# EAGLE schematic telemetry (EAGLE 9.2.1)
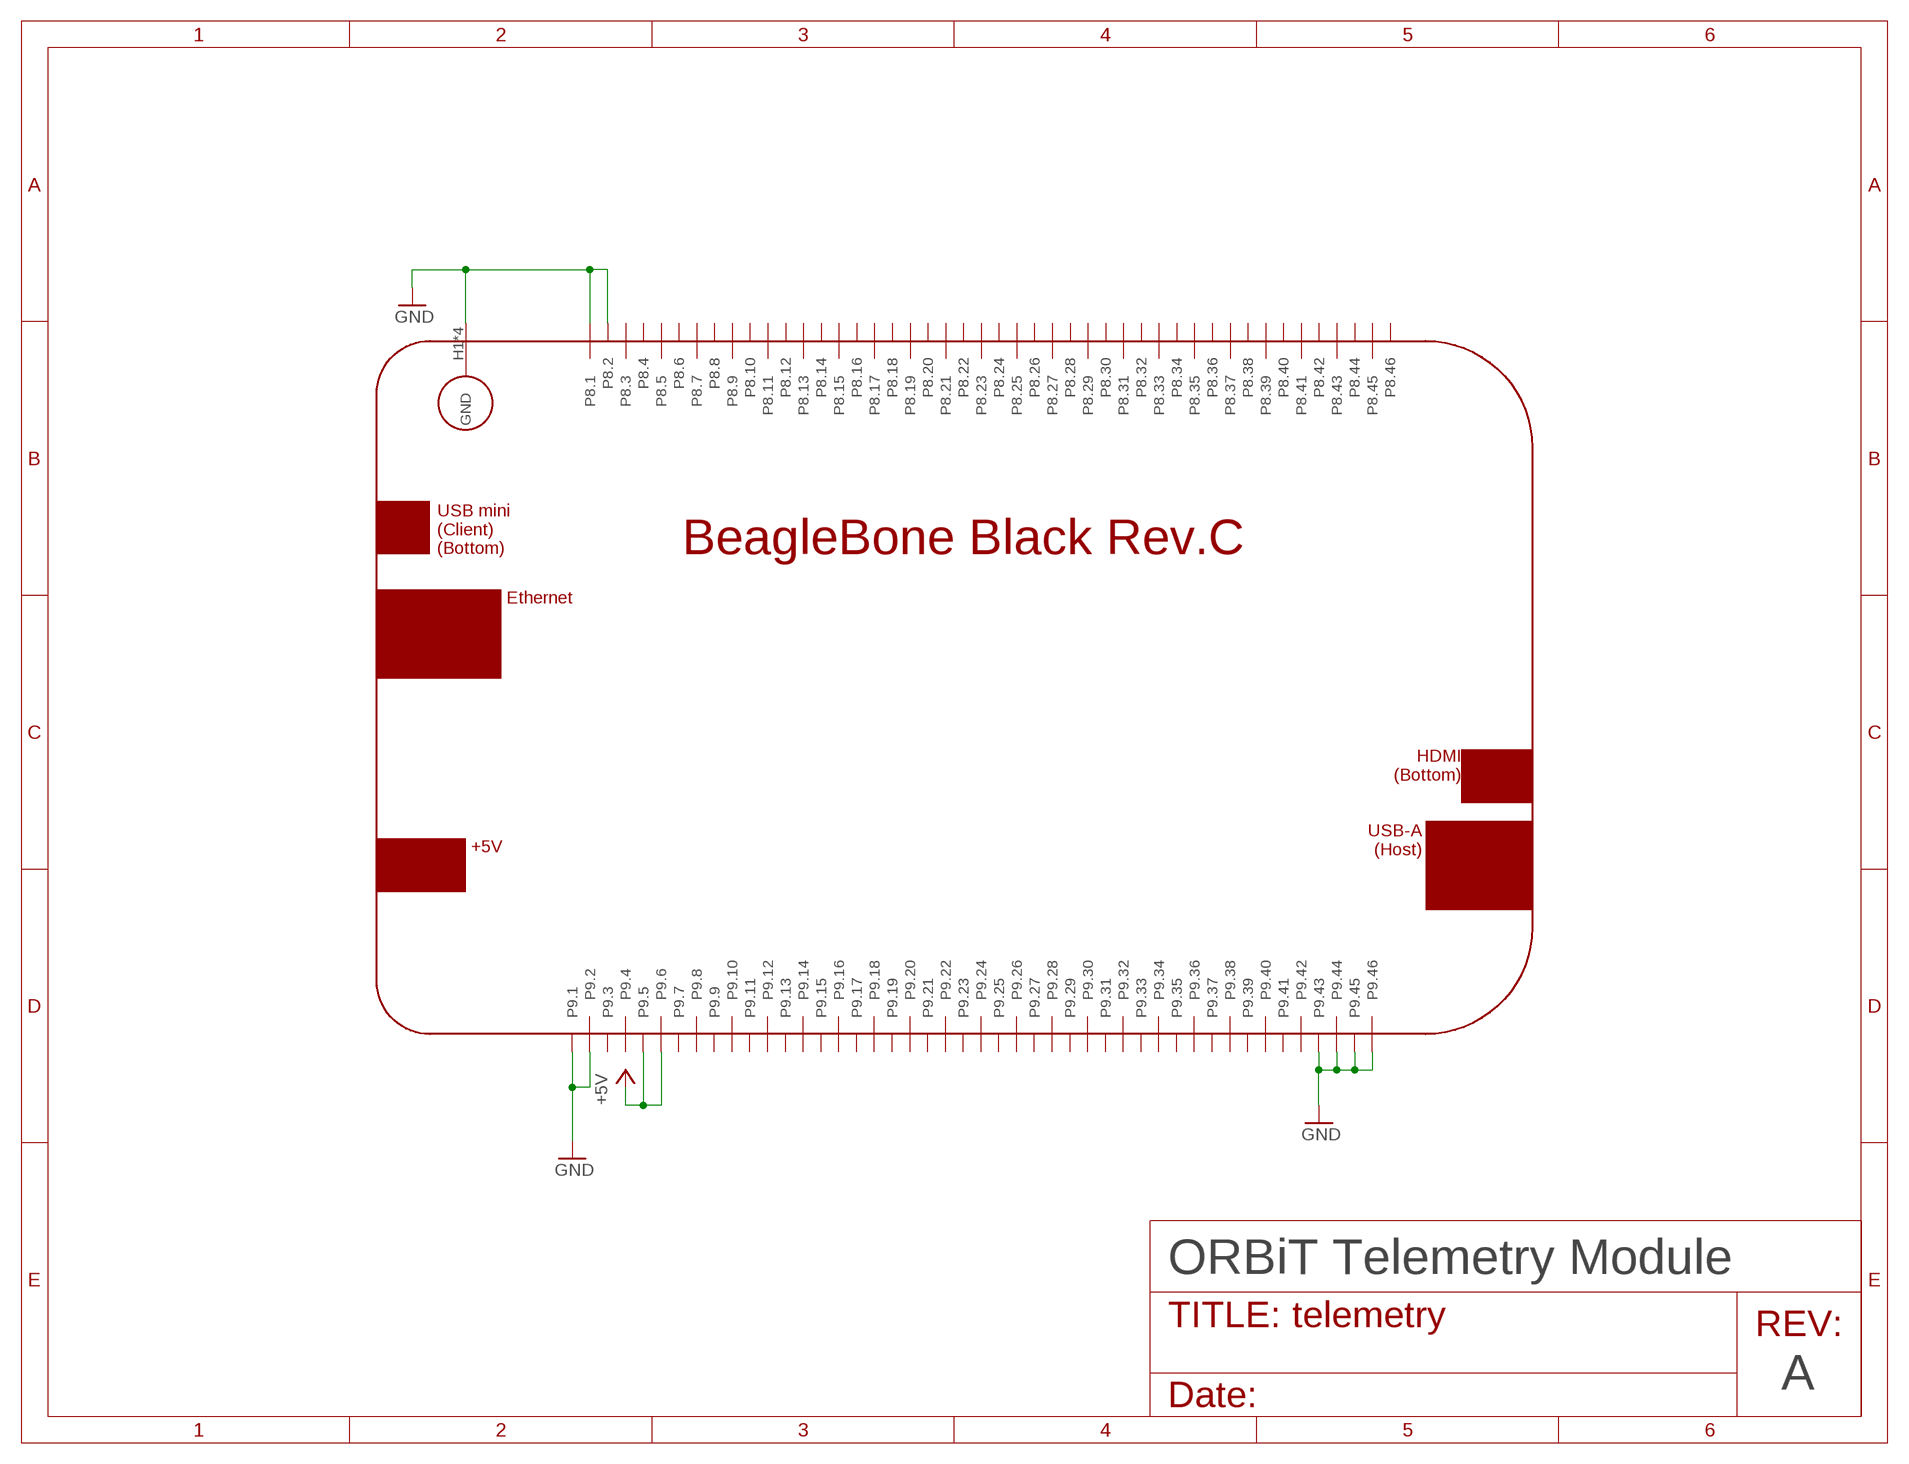
[diagram p0: schematic, sheet 1]

## Parts
PCB1  BBB_CAPE-CUT  [BBB_CAPE_CUT]

## Nets
+5V: PCB1.P9.5 PCB1.P9.6
GND: PCB1.H1(GND) PCB1.H2(GND) PCB1.H3(GND) PCB1.H4(GND) PCB1.P8.1 PCB1.P8.2 PCB1.P9.1 PCB1.P9.2 PCB1.P9.43 PCB1.P9.44 PCB1.P9.45 PCB1.P9.46
Unconnected: PCB1.P8.3 PCB1.P8.4 PCB1.P8.5 PCB1.P8.6 PCB1.P8.7 PCB1.P8.8 PCB1.P8.9 PCB1.P8.10 PCB1.P8.11 PCB1.P8.12 PCB1.P8.13 PCB1.P8.14 PCB1.P8.15 PCB1.P8.16 PCB1.P8.17 PCB1.P8.18 PCB1.P8.19 PCB1.P8.20 PCB1.P8.21 PCB1.P8.22 PCB1.P8.23 PCB1.P8.24 PCB1.P8.25 PCB1.P8.26 PCB1.P8.27 PCB1.P8.28 PCB1.P8.29 PCB1.P8.30 PCB1.P8.31 PCB1.P8.32 PCB1.P8.33 PCB1.P8.34 PCB1.P8.35 PCB1.P8.36 PCB1.P8.37 PCB1.P8.38 PCB1.P8.39 PCB1.P8.40 PCB1.P8.41 PCB1.P8.42 PCB1.P8.43 PCB1.P8.44 PCB1.P8.45 PCB1.P8.46 PCB1.P9.3 PCB1.P9.4 PCB1.P9.7 PCB1.P9.8 PCB1.P9.9 PCB1.P9.10 PCB1.P9.11 PCB1.P9.12 PCB1.P9.13 PCB1.P9.14 PCB1.P9.15 PCB1.P9.16 PCB1.P9.17 PCB1.P9.18 PCB1.P9.19 PCB1.P9.20 PCB1.P9.21 PCB1.P9.22 PCB1.P9.23 PCB1.P9.24 PCB1.P9.25 PCB1.P9.26 PCB1.P9.27 PCB1.P9.28 PCB1.P9.29 PCB1.P9.30 PCB1.P9.31 PCB1.P9.32 PCB1.P9.33 PCB1.P9.34 PCB1.P9.35 PCB1.P9.36 PCB1.P9.37 PCB1.P9.38 PCB1.P9.39 PCB1.P9.40 PCB1.P9.41 PCB1.P9.42

## Notes on the sheet
- ORBiT Telemetry Module
- A

## Library data of the parts
PCB1 = ORBiT-modules:BBB_CAPE: BeagleBone Black Rev. C The BeagleBone Black (BBONE-BLACK-4G) is a low cost, high-expansion focused BeagleBoard using a low cost Sitara™ AM3358 ARM® Cortex™-A8 processor from Texas Instruments. BBONE-BLACK-4G ships with the Ångström Linux distribution preinstalled on the onboard FLASH, ready to start evaluation and development. Many other Linux distributions and operating systems are also supported by BeagleBone Black including Ubuntu, Android, and Fedora. Like its predecessors, the BeagleBone Black is designed to address the Open Source Community, early adopters, and anyone interested in a low cost ARM® Cortex™-A8 based processor. It has been equipped with a minimum set of features to allow the user to experience the power of the processor and also offers access to many of the interfaces and allows for the use of add-on boards called capes, to add many different combinations of features. A user may also develop their own board or add their own circuitry. The BBONE-BLACK-4G features TI's Sitara™ AM3358AZCZ100 microprocessor, which is based on ARM®Cortex™-A8 core with enhanced image, graphics processing, peripherals and industrial interface options such as EtherCAT and PROFIBUS. The board is equipped with 256Mb x16 DDR3L 4Gb (512MB) SDRAM, 32KB EEPROM, and 4GB embedded MMC (eMMC) Flash as the default boot source. The board is also populated with a single microSD connector to act as a secondary boot source for the board and, if selected as such, can be the primary boot source. The BeagleBone Black supports four boot modes, including eMMC boot, microSD boot, serial boot, and USB boot. A switch is provided to allow switching between the modes. In contrast to the original BeagleBone, the BBONE-BLACK-4G has an onboard HDMI interface to connect directly to TVs and monitors. Other features include a 10/100 Ethernet interface, a serial debug port, a PC USB interface, an USB 2.0 host port, a reset button, a power button, and five indicating blue LEDs. The BeagleBone Black has the ability to accept up to four expansion boards or capes that can be stacked onto the expansion headers. The majority of capes designed for the original BeagleBone will work on the BeagleBone Black. Technical Data: beagleboard.org <https://beagleboard.org/black>; MF: BeagleBoard; MPN: BBONE-BLACK-4G; PN_DIGIKEY: BBB01-SC-505-ND; PN_MOUSER: 958-BBB01-SC-505